# EasyEDA schematic SCH_TCC-ESP32_2025-09-30.json
TITLE: Sheet_1; REV: 1.0; Date: 2025-03-17; Sheet: 1/1; Drawn By: gisilvestrim; Company: Your Company
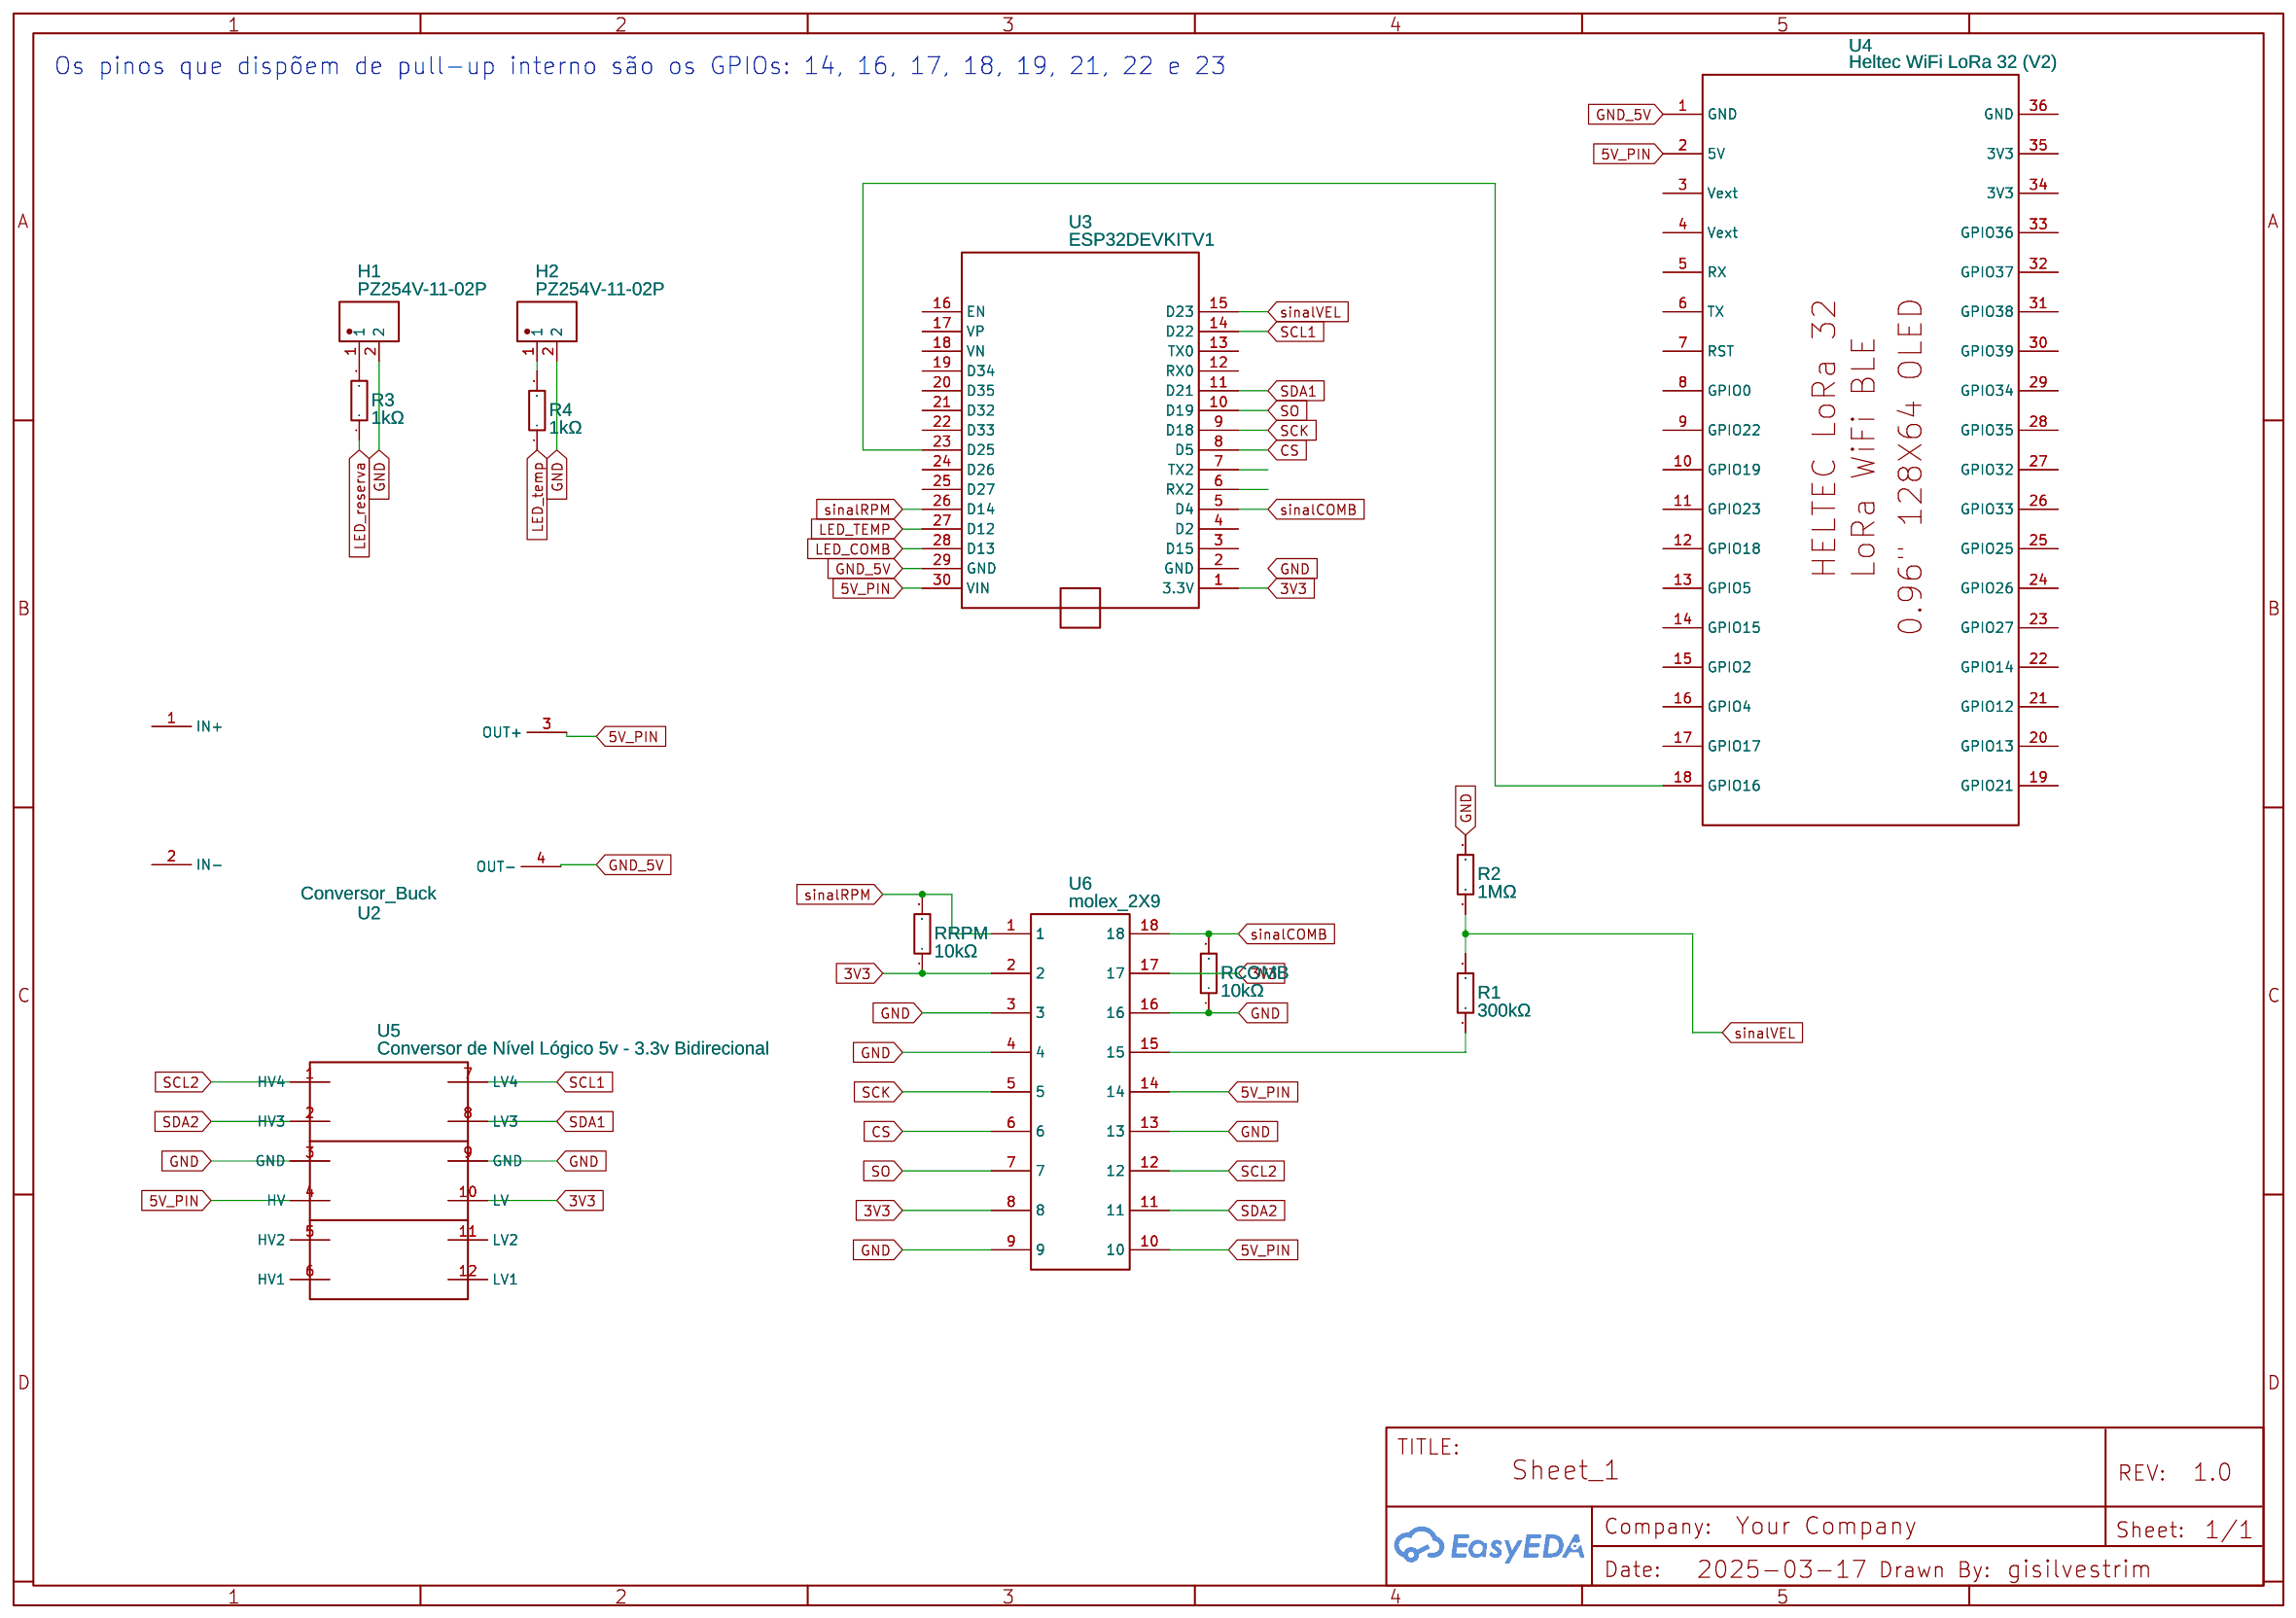
[diagram p0: schematic sheet]

## Parts
H1  PZ254V-11-02P  [HDR-TH_2P-P2.54-V-M]
H2  PZ254V-11-02P  [HDR-TH_2P-P2.54-V-M]
R1  300kΩ  [R0402]
R2  1MΩ  [R0402]
R3  1kΩ  [R0603]
R4  1kΩ  [R0603]
RCOMB  10kΩ  [R0402]
RRPM  10kΩ  [R0402]
U2  Conversor_Buck  [CONVERSOR_BUCK_PCB]
U3  ESP32DEVKITV1  [ESP32DEVKITV1]
U4  Heltec WiFi LoRa 32 (V2)  [HELTEC-LORA32-WIFI-BLE-OLED]
U5  Conversor de Nível Lógico 5v - 3.3v Bidirecional  [CONVERSOR DE NÍVEL LÓGICO 5V - 3.3V BIDIRECIONAL]
U6  molex_2X9  [2X9MOLEX]

## Library data of the parts
H1 H2 = PZ254V-11-02P: Contributor: LCSC; Supplier: LCSC; Supplier Part: C492401; Manufacturer: XFCN(兴飞); JLCPCB Part Class: Extended Part
R1 = RC0402FR-07300KL: Supplier: LCSC; Manufacturer: YAGEO(国巨); Supplier Part: C138011; JLCPCB Part Class: Extended Part
R2 = RC0402FR-071ML: Supplier: LCSC; Manufacturer: YAGEO(国巨); Supplier Part: C138033; JLCPCB Part Class: Extended Part
R3 R4 = RC0603FR-071KL: Supplier: LCSC; Manufacturer: YAGEO(国巨); Supplier Part: C22548; JLCPCB Part Class: Extended Part
RCOMB RRPM = RC0402FR-0710KL: Supplier: LCSC; Manufacturer: YAGEO(国巨); Supplier Part: C60490; JLCPCB Part Class: Extended Part
U2 = Conversor_Buck: Contributor: josp1
U3 = ESP32DEVKITV1: Contributor: sreejeesh
U4 = Heltec WiFi LoRa 32 (V2): Manufacturer: Heltec; Manufacturer Part: Heltec WiFi LoRa 32(V2); Supplier: Heltec; Supplier Part: Heltec WiFi LoRa 32(V2); link: https://heltec.org/project/wifi-lora-32/; Contributor: Domino2205
U5 = Conversor de Nível Lógico 5v - 3.3v Bidirecional: Contributor: RaspAutomacao
U6 = molex_2X9: Contributor: jjesus.mendoza.mendoza

## Nets
3V3: RRPM.1 U3.1(3.3V) U5.10(LV) U6.2 U6.8 U6.17
5V_PIN: U2.3(OUT+) U3.30(VIN) U4.2(5V) U5.4(HV) U6.10 U6.14
GND: H1.2 H2.2 R2.2 RCOMB.1 U5.3(GND) U5.9(GND) U6.3 U6.4 U6.9 U6.13 U6.16
GND_5V: U2.4(OUT-) U3.29(GND) U4.1(GND)
CS: U3.8(D5) U6.6
LED_COMB: U3.28(D13)
LED_reserva: R3.1
LED_TEMP: U3.27(D12)
LED_temp: R4.1
SCK: U3.9(D18) U6.5
SCL1: U3.14(D22) U5.7(LV4)
SCL2: U5.1(HV4) U6.12
SDA1: U3.11(D21) U5.8(LV3)
SDA2: U5.2(HV3) U6.11
sinalCOMB: RCOMB.2 U3.5(D4) U6.18
sinalRPM: RRPM.2 U3.26(D14) U6.1
sinalVEL: R1.2 R2.1 U3.15(D23)
SO: U3.10(D19) U6.7
Net-(H1-1): H1.1 R3.2
Net-(H2-1): H2.1 R4.2
Net-(R1-1): R1.1 U6.15
Net-(U3-23): U3.23(D25) U4.18(GPIO16)

Not connected (* = marked no-connect by the designer): U2 1(IN+) 2(IN-); U3 2(GND) 3(D15) 4(D2) 6(RX2) 7(TX2) 12(RX0) 13(TX0) 16(EN) 17(VP) 18(VN) 19(D34) 20(D35) 21(D32) 22(D33) 24(D26) 25(D27); U4 3(Vext) 4(Vext) 5(RX) 6(TX) 7(RST) 8(GPIO0) 9(GPIO22) 10(GPIO19) 11(GPIO23) 12(GPIO18) 13(GPIO5) 14(GPIO15) 15(GPIO2) 16(GPIO4) 17(GPIO17) 19(GPIO21) 20(GPIO13) 21(GPIO12) 22(GPIO14) 23(GPIO27) 24(GPIO26) 25(GPIO25) 26(GPIO33) 27(GPIO32) 28(GPIO35) 29(GPIO34) 30(GPIO39) 31(GPIO38) 32(GPIO37) 33(GPIO36) 34(3V3) 35(3V3) 36(GND); U5 5(HV2) 6(HV1) 11(LV2) 12(LV1)

## Notes on the sheet
- Os pinos que dispõem de pull-up interno são os GPIOs: 14, 16, 17, 18, 19, 21, 22 e 23
